# EAGLE design ProgrammateurFilPilote_1.1.1 (EAGLE 6.5.0)
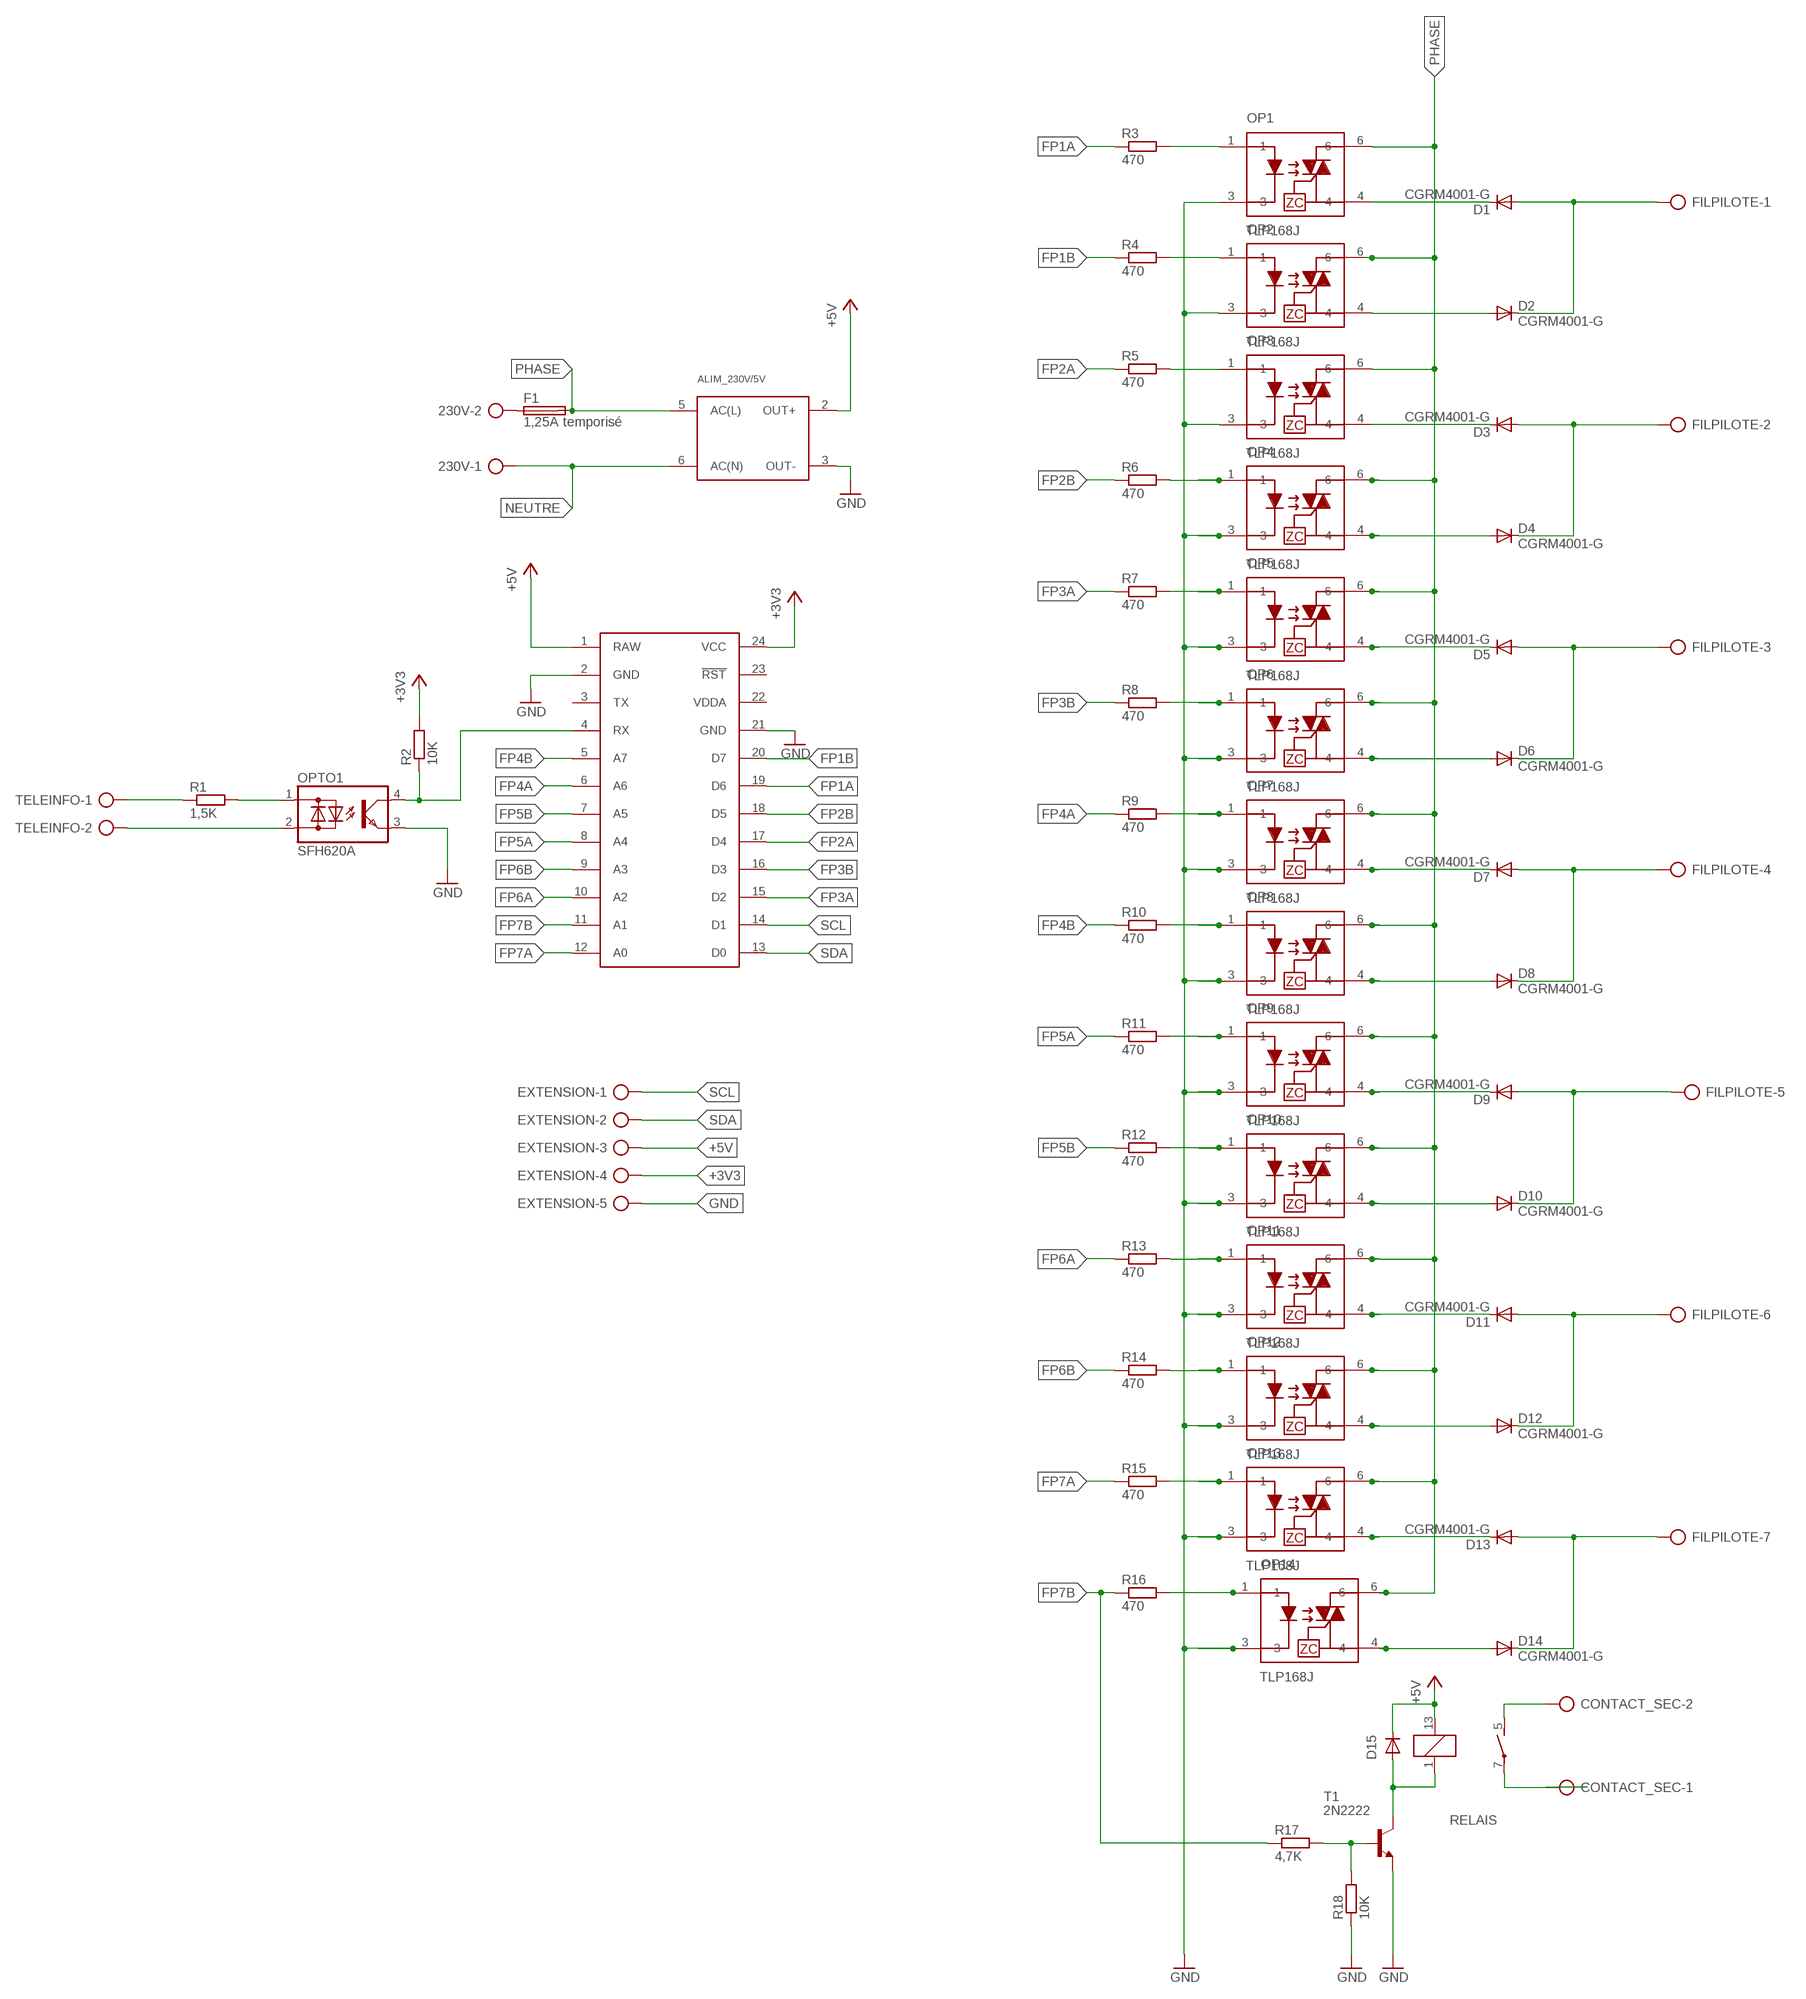
[diagram p0: schematic, sheet 1]

## Parts
230V  AK500/2  [AK500/2]
ALIM_230V/5V  TMLM04-SINGLE  [TMLM04]
CONTACT_SEC  AK500/2  [AK500/2]
D1  CGRM4001-G  [SOD-123_MINI-SMA]
D2  CGRM4001-G  [SOD-123_MINI-SMA]
D3  CGRM4001-G  [SOD-123_MINI-SMA]
D4  CGRM4001-G  [SOD-123_MINI-SMA]
D5  CGRM4001-G  [SOD-123_MINI-SMA]
D6  CGRM4001-G  [SOD-123_MINI-SMA]
D7  CGRM4001-G  [SOD-123_MINI-SMA]
D8  CGRM4001-G  [SOD-123_MINI-SMA]
D9  CGRM4001-G  [SOD-123_MINI-SMA]
D10  CGRM4001-G  [SOD-123_MINI-SMA]
D11  CGRM4001-G  [SOD-123_MINI-SMA]
D12  CGRM4001-G  [SOD-123_MINI-SMA]
D13  CGRM4001-G  [SOD-123_MINI-SMA]
D14  CGRM4001-G  [SOD-123_MINI-SMA]
D15  CGRM4001-G  [SOD-123_MINI-SMA]
EXTENSION  AK500/5  [AK500/5]
F1  1,25A temporisé  TE5  [TE5]
FILPILOTE  AK500/7  [AK500/7]
OP1  TLP168J  [MFSOP-4]
OP2  TLP168J  [MFSOP-4]
OP3  TLP168J  [MFSOP-4]
OP4  TLP168J  [MFSOP-4]
OP5  TLP168J  [MFSOP-4]
OP6  TLP168J  [MFSOP-4]
OP7  TLP168J  [MFSOP-4]
OP8  TLP168J  [MFSOP-4]
OP9  TLP168J  [MFSOP-4]
OP10  TLP168J  [MFSOP-4]
OP11  TLP168J  [MFSOP-4]
OP12  TLP168J  [MFSOP-4]
OP13  TLP168J  [MFSOP-4]
OP14  TLP168J  [MFSOP-4]
OPTO1  SFH620A  [DIL04]
R1  1,5K  R-EU_R1206  [R1206]
R2  10K  R-EU_R1206  [R1206]
R3  470  R-EU_R1206  [R1206]
R4  470  R-EU_R1206  [R1206]
R5  470  R-EU_R1206  [R1206]
R6  470  R-EU_R1206  [R1206]
R7  470  R-EU_R1206  [R1206]
R8  470  R-EU_R1206  [R1206]
R9  470  R-EU_R1206  [R1206]
R10  470  R-EU_R1206  [R1206]
R11  470  R-EU_R1206  [R1206]
R12  470  R-EU_R1206  [R1206]
R13  470  R-EU_R1206  [R1206]
R14  470  R-EU_R1206  [R1206]
R15  470  R-EU_R1206  [R1206]
R16  470  R-EU_R1206  [R1206]
R17  4,7K  R-EU_R1206  [R1206]
R18  10K  R-EU_R1206  [R1206]
RELAIS  Relais G6D  G6D-1A-ASI12VDC  [G6D]
SPARKCORE  SPARK_CORECORE  [SPARK_CORE]
T1  2N2222  2N2222-NPN-TO92-EBC  [TO92-EBC]
TELEINFO  AK500/2  [AK500/2]

## Nets
+3V3: EXTENSION.4 R2.2 SPARKCORE.24(VCC)
+5V: ALIM_230V/5V.2(OUT+) D15.C EXTENSION.3 RELAIS.13 SPARKCORE.1(RAW)
FP1A: R3.1 SPARKCORE.19(D6)
FP1B: R4.1 SPARKCORE.20(D7)
FP2A: R5.1 SPARKCORE.17(D4)
FP2B: R6.1 SPARKCORE.18(D5)
FP3A: R7.1 SPARKCORE.15(D2)
FP3B: R8.1 SPARKCORE.16(D3)
FP4A: R9.1 SPARKCORE.6(A6)
FP4B: R10.1 SPARKCORE.5(A7)
FP5A: R11.1 SPARKCORE.8(A4)
FP5B: R12.1 SPARKCORE.7(A5)
FP6A: R13.1 SPARKCORE.10(A2)
FP6B: R14.1 SPARKCORE.9(A3)
FP7A: R15.1 SPARKCORE.12(A0)
FP7B: R16.1 R17.1 SPARKCORE.11(A1)
GND: ALIM_230V/5V.3(OUT-) EXTENSION.5 OP1.3 OP2.3 OP3.3 OP4.3 OP5.3 OP6.3 OP7.3 OP8.3 OP9.3 OP10.3 OP11.3 OP12.3 OP13.3 OP14.3 OPTO1.3(E) R18.1 SPARKCORE.2(GND) SPARKCORE.21(GND) T1.E
N$1: D1.C OP1.4
N$2: D2.A OP2.4
N$3: OPTO1.2(AC2) TELEINFO.2
N$4: OPTO1.1(AC1) R1.2
N$5: R1.1 TELEINFO.1
N$6: OPTO1.4(C) R2.1 SPARKCORE.4(RX)
N$7: OP1.1 R3.2
N$8: OP2.1 R4.2
N$9: OP3.1 R5.2
N$10: OP4.1 R6.2
N$11: OP5.1 R7.2
N$12: OP6.1 R8.2
N$13: OP7.1 R9.2
N$14: OP8.1 R10.2
N$15: D15.A RELAIS.1 T1.C
N$17: 230V.2 F1.1
N$18: CONTACT_SEC.2 RELAIS.5(2:S)
N$19: OP9.1 R11.2
N$20: CONTACT_SEC.1 RELAIS.7(2:P)
N$21: R17.2 R18.2 T1.B
N$22: D3.C OP3.4
N$23: D3.A D4.C FILPILOTE.2
N$24: D5.C OP5.4
N$25: D4.A OP4.4
N$26: D7.C OP7.4
N$27: D5.A D6.C FILPILOTE.3
N$28: D1.A D2.C FILPILOTE.1
N$29: D6.A OP6.4
N$30: D7.A D8.C FILPILOTE.4
N$31: D8.A OP8.4
N$32: OP10.1 R12.2
N$34: OP14.1 R16.2
N$42: D9.C OP9.4
N$46: D9.A D10.C FILPILOTE.5
N$47: OP11.1 R13.2
N$48: OP12.1 R14.2
N$49: D10.A OP10.4
N$50: D11.A D12.C FILPILOTE.6
N$51: D12.A OP12.4
NEUTRE: 230V.1 ALIM_230V/5V.6(AC(N))
PHASE: ALIM_230V/5V.5(AC(L)) F1.2 OP1.6 OP2.6 OP3.6 OP4.6 OP5.6 OP6.6 OP7.6 OP8.6 OP9.6 OP10.6 OP11.6 OP12.6 OP13.6 OP14.6
S$1: D11.C OP11.4
S$3: D13.C OP13.4
S$5: OP13.1 R15.2
S$6: D13.A D14.C FILPILOTE.7
S$11: D14.A OP14.4
SCL: EXTENSION.1 SPARKCORE.14(D1)
SDA: EXTENSION.2 SPARKCORE.13(D0)
Unconnected: SPARKCORE.3(TX) SPARKCORE.23(!RST)

## Power pins joined to a net without a drawn wire
VDDA: SPARKCORE.22(VDDA)

## Library data of the parts
230V TELEINFO = con-ptr500:AK500/2: CONNECTOR; OC_FARNELL: unknown; OC_NEWARK: unknown
ALIM_230V/5V = Traco-TMLM04:TMLM04-SINGLE
CONTACT_SEC = con-ptr500:AK500/2: CONNECTOR
D1-D15 = diode:CGRM400*-G: Molded plasitc,JEDEC SOD-123/Mini SMA Source: Comchip CGRM4001-G.pdf
EXTENSION = con-ptr500:AK500/5: CONNECTOR; OC_FARNELL: unknown; OC_NEWARK: unknown
F1 = fuse:TE5: FUSE Wickmann; OC_FARNELL: unknown; OC_NEWARK: unknown
FILPILOTE = con-ptr500:AK500/7: CONNECTOR; OC_FARNELL: unknown; OC_NEWARK: unknown
OP1-OP14 = TLP168J:TLP168J
OPTO1 = optocoupler:SFH620: Optocoupler, Phototransistor Output, AC Input Source: http://www.vishay.com/docs/83675/sfh620.pdf; MPN: SFH620A-2; OC_FARNELL: 1469594; OC_NEWARK: 97K9546
R1-R18 = resistor:R-EU_: RESISTOR, European symbol
RELAIS = relay:G6D?*: OMRON Slim, Miniature PCB Relay 17.5 × 6.5 × 12.5 mm with Socked Source: http://ecb.omron.com.sg/pdf/relay/power/G6D.pdf
SPARKCORE = Spark:SPARK_CORE
T1 = transistor-neu-to92:*-NPN-: NPN Transistror

## Net classes
0 default: width 0.305 mm, drill 0.508 mm, clearance 0.254 mm

## Board
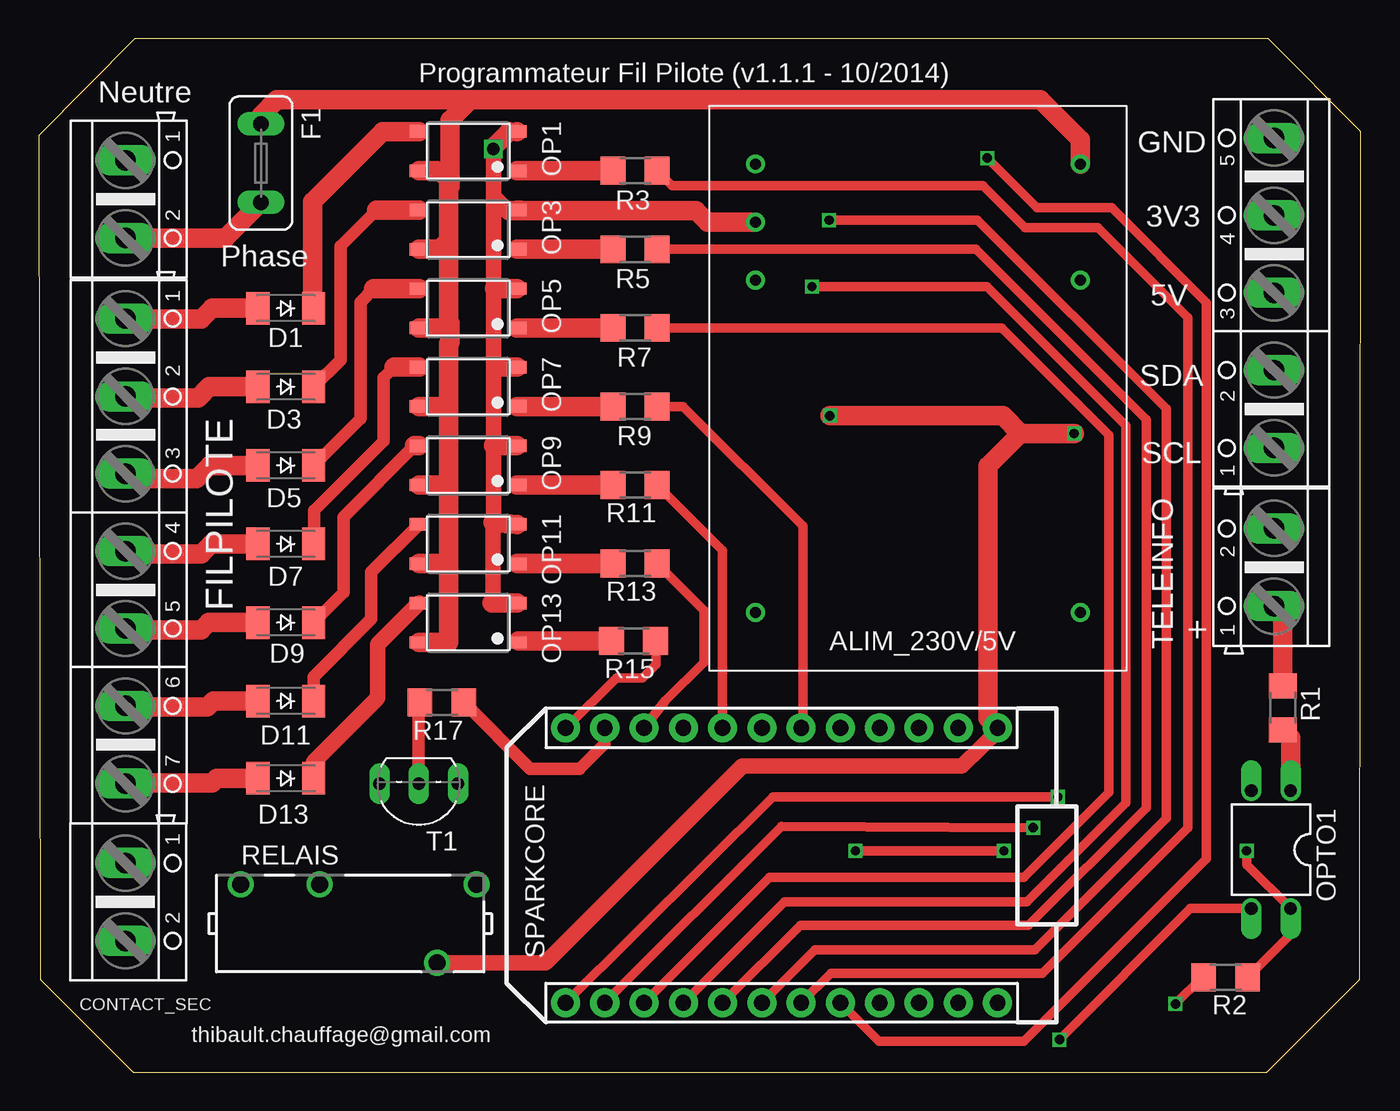
[diagram p1: board, top side]
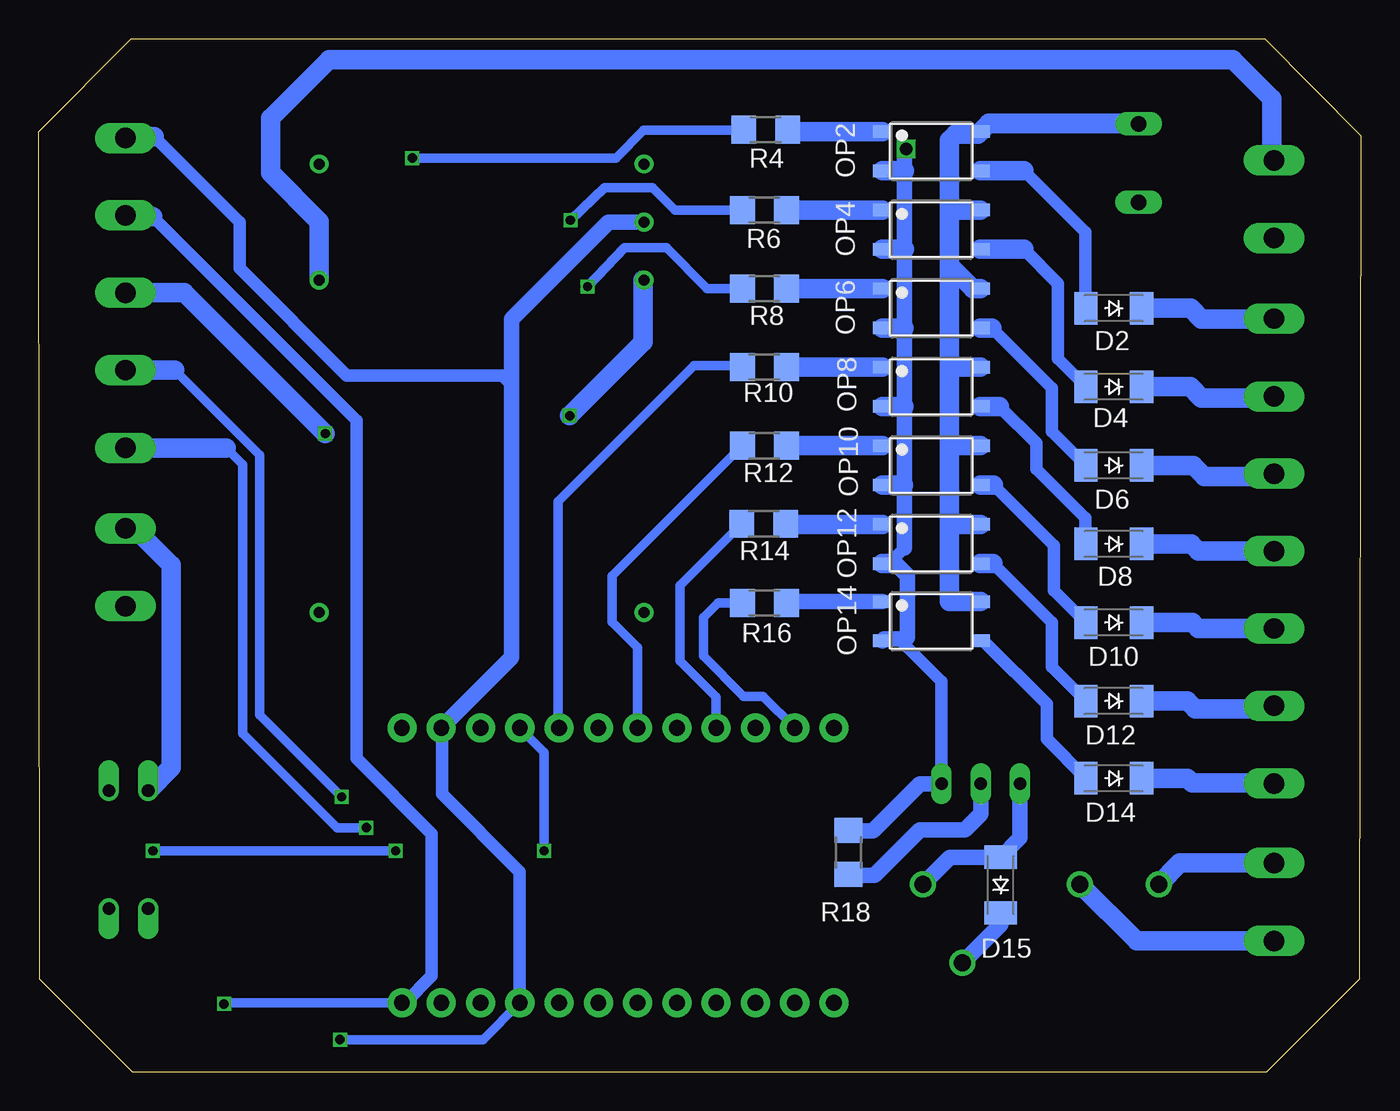
[diagram p2: board, bottom side, seen from below]

Size 85.49 x 66.83 mm. Coordinates in mm from the lower left corner, seen from the top.
Outline: 0,60.54 0.12,6.01 6.12,0 79.41,0 85.41,5.99 85.49,60.82 79.49,66.83 6.2,66.83 0,60.54
Copper layers (1*16): Top 0.035mm / dielectric 1.5mm / Bottom 0.035mm
Design rules "Elecrow_2-layer_eagle_rule": minimum track width 6mil, minimum drill 12mil, track to track 6mil, track to pad 6mil, pad to pad 6mil, via to via 6mil, smd to smd 0mil, copper to edge 10mil, drill to drill 10mil, minimum pad ring 10mil, minimum via ring 6mil, stop-mask expansion 2mil, vias tented up to drill 100mil, thermal gap 10mil

### Footprints (pad centres in the part's own frame; a part is rotated, then mirrored left to right if it is on the bottom)
AK500/2 = drill 1.321 long: 1 -2.515,0; 2 2.515,0
TMLM04 = drill 0.7: 1 3,3.75; 2 3,25.25; 3 3,29; 4 3,32.75; 5 24,32.75; 6 24,25.25; 7 24,3.75
SOD-123_MINI-SMA = smd 1.5 x 2.1: A 1.8,0; C -1.8,0
AK500/5 = drill 1.321 long: 1 -10.033,0; 2 -5.004,0; 3 0,0; 4 5.004,0; 5 10.008,0
TE5 = drill 1.016 long: 1 -2.54,0; 2 2.54,0
AK500/7 = drill 1.321 long: 1 -15.037,0; 2 -10.008,0; 3 -5.004,0; 4 0,0; 5 5.004,0; 6 10.008,0; 7 15.037,0
MFSOP-4 = smd 0.8 x 1.2: 1 2.54,0; 3 0,0; 4 0,-6.35; 6 2.54,-6.35
DIL04 = drill 0.813 offset: 1 -1.27,-3.81; 2 1.27,-3.81; 3 1.27,3.81; 4 -1.27,3.81
R1206 = smd 1.6 x 1.803: 1 -1.422,0; 2 1.422,0
G6D = drill 1.1 pad 1.676: 1 8.08,2.5; 5 -2.08,2.5; 7 -7.16,2.5; 13 5.54,-2.58
SPARK_CORE = drill 1.016 pad 1.88: 1 -8.89,13.97; 2 -8.89,11.43; 3 -8.89,8.89; 4 -8.89,6.35; 5 -8.89,3.81; 6 -8.89,1.27; 7 -8.89,-1.27; 8 -8.89,-3.81; 9 -8.89,-6.35; 10 -8.89,-8.89; 11 -8.89,-11.43; 12 -8.89,-13.97; 13 8.89,-13.97; 14 8.89,-11.43; 15 8.89,-8.89; 16 8.89,-6.35; 17 8.89,-3.81; 18 8.89,-1.27; 19 8.89,1.27; 20 8.89,3.81; 21 8.89,6.35; 22 8.89,8.89; 23 8.89,11.43; 24 8.89,13.97
TO92-EBC = drill 0.813 long: B 0,-1.27; C 2.54,-1.27; E -2.54,-1.27

### Placement (x,y rotation side)
230V  5.62,56.45 270 top
ALIM_230V/5V  43.35,25.97 0 top
CONTACT_SEC  5.61,11 270 top
D1  15.97,49.39 180 top
D2  15.97,49.39 180 bottom
D3  15.97,44.31 180 top
D4  15.97,44.31 180 bottom
D5  15.97,39.23 180 top
D6  15.97,39.23 180 bottom
D7  15.97,34.16 180 top
D8  15.97,34.16 180 bottom
D9  15.97,29.07 180 top
D10  15.97,29.07 180 bottom
D11  15.97,23.99 180 top
D12  15.97,23.99 180 bottom
D13  15.97,18.99 180 top
D14  15.97,18.99 180 bottom
D15  23.29,12.1 90 bottom
EXTENSION  79.89,50.4 90 top
F1  14.37,58.78 90 top
FILPILOTE  5.62,33.69 270 top
OP1  30.94,60.82 270 top
OP2  30.94,58.28 90 bottom
OP3  30.94,55.74 270 top
OP4  30.94,53.2 90 bottom
OP5  30.94,50.66 270 top
OP6  30.94,48.12 90 bottom
OP7  30.94,45.59 270 top
OP8  30.94,43.05 90 bottom
OP9  30.94,40.5 270 top
OP10  30.94,37.96 90 bottom
OP11  30.94,35.42 270 top
OP12  30.94,32.88 90 bottom
OP13  30.94,30.32 270 top
OP14  30.94,27.88 90 bottom
OPTO1  79.68,14.38 180 top
R1  80.44,23.55 270 top
R2  76.75,6.14 180 top
R3  38.56,58.28 180 top
R4  38.48,60.93 0 bottom
R5  38.56,53.2 180 top
R6  38.56,55.74 0 bottom
R7  38.56,48.12 180 top
R8  38.56,50.66 0 bottom
R9  38.56,43.05 180 top
R10  38.56,45.59 0 bottom
R11  38.56,37.96 180 top
R12  38.56,40.5 0 bottom
R13  38.56,32.88 180 top
R14  38.61,35.46 0 bottom
R15  38.46,27.88 180 top
R16  38.56,30.34 0 bottom
R17  26.08,23.89 180 top
R18  33.13,14.2 270 bottom
RELAIS  20.24,9.64 0 top
SPARKCORE  48.03,13.37 270 top
T1  24.57,17.37 180 top
TELEINFO  79.89,32.65 90 top

### Tracks (layer width: path | path; a pad name or v marks a point on that pad's centre or on a via)
+3V3  (via drill 0.6)
  Top 0.61: R2.2 75.25,6.14 v73.51,4.4
  Bottom 0.61: SPARKCORE.24 73.43,4.47 v73.51,4.4
  Bottom 0.813: SPARKCORE.24 61.81,4.47 60.07,6.22 60.07,15.42 64.95,20.3 64.95,42.14 78.14,55.33
  Bottom 1.27: 78.14,55.33 79.81,55.33 EXTENSION.4
+5V  (via drill 0.6)
  Top 0.813: 62.11,22.15 SPARKCORE.1
  Top 1.016: 62.11,22.15 59.71,19.8 45.51,19.8 32.77,7.06 RELAIS.13
  Top 1.27: 63.49,41.31 61.37,39.2 61.37,22.89 SPARKCORE.1 | v66.96,41.29 63.51,41.29 63.49,41.31 | v51.15,42.45 62.35,42.45 63.49,41.31
  Bottom 1.016: D15.C 23.29,9.55 RELAIS.13 | ALIM_230V/5V.2 46.41,51.22
  Bottom 1.27: EXTENSION.3 76.07,50.4 v66.96,41.29 | 46.41,51.22 46.41,47.19 v51.15,42.45
FP1A
  Top 0.61: SPARKCORE.19 51.23,6.4 64.91,6.4 74.31,15.8 74.31,48.79 68.48,54.62 63.77,54.62 61.07,57.32 40.95,57.32 R3.1
FP1B  (via drill 0.6)
  Top 0.61: SPARKCORE.20 54.32,2 63.71,2 75.51,13.8 75.51,49.77 69.38,55.9 64.54,55.9 v61.33,59.11
  Bottom 0.61: v61.33,59.11 48.16,59.11 46.38,60.9 39.94,60.9 R4.1
  Bottom 0.813: R4.1 39.9,61 39.81,61.1
FP2A
  Top 0.61: R5.1 60.6,53.2 71.61,42.2 71.61,17.1 64.01,9.5 49.25,9.5 SPARKCORE.17
FP2B  (via drill 0.6)
  Top 0.61: v51.11,55.1 60.71,55.1 72.91,42.9 72.91,16.4 64.41,7.9 50.19,7.9 SPARKCORE.18
  Bottom 0.61: R6.1 44.35,55.74 45.81,57.2 48.91,57.2 v51.11,55.1
FP3A
  Top 0.61: R7.1 62.28,48.12 69.21,41.2 69.21,18.1 63.71,12.6 47.27,12.6 SPARKCORE.15
FP3B  (via drill 0.6)
  Top 0.61: v50.01,50.8 61.31,50.8 70.31,41.8 70.31,17.4 63.91,11 48.21,11 SPARKCORE.16
  Bottom 0.61: R8.1 42.27,50.66 44.91,53.3 47.61,53.3 v50.01,50.8
FP4A
  Top 0.61: R9.1 41.66,43.05 49.41,35.3 49.41,22.36 SPARKCORE.6
FP4B
  Bottom 0.61: R10.1 40.09,45.59 40.21,45.7 43.11,45.7 51.91,36.9 51.91,22.32 SPARKCORE.5
FP5A
  Top 0.61: SPARKCORE.8 44.22,33.73 R11.1
FP5B
  Bottom 0.61: SPARKCORE.7 46.76,27.45 48.41,29.1 48.41,32.08 R12.1
FP6A
  Top 0.61: SPARKCORE.10 40.54,24.04 43.01,26.5 43.01,29.86 R13.1
FP6B
  Bottom 0.61: SPARKCORE.9 41.68,24.27 44.01,26.6 44.01,31.48 R14.1
FP7A
  Top 0.61: SPARKCORE.12 34.11,22.25 37.35,25.5 39.04,25.5 39.91,26.37 39.91,27.86 R15.1
FP7B
  Top 0.813: SPARKCORE.11 36.6,21.23 34.98,19.61 31.79,19.61 R17.1
  Bottom 0.61: R16.1 41.56,30.34 42.51,29.4 42.51,26.9 39.91,24.3 38.65,24.3 SPARKCORE.11
GND  (via drill 0.6, 0.8)
  Top 0.61: OPTO1.3 74.48,10.58 v66.01,2.1 | 30.41,55.7 29.41,56.7
  Top 0.813: OP3.3 30.97,55.74 31.19,55.97 | 30.99,55.7 30.51,55.7 29.41,56.8 | 30.92,60.8 30.41,60.8 30.21,60.8 29.41,60 v29.41,59.7 29.41,59.8 | 29.38,35.52 29.41,35.6 | 29.41,40.5 | 29.69,45.59 29.41,45.3 | 29.47,50.66 29.41,50.6
  Top 1.016: 29.41,56.8 v29.41,59.7 | 29.41,56.7 29.41,50.6 29.41,45.3 29.41,40.5 29.41,35.6 | 29.31,30.32 29.31,30.3 29.38,30.4 29.38,35.52
  Top 1.27: ALIM_230V/5V.3 43.24,54.97 42.51,55.7 30.99,55.7 | 30.99,55.7 OP3.3 | 30.92,60.8 OP1.3 | 30.99,55.7 30.41,55.7 | OP11.3 29.38,35.52 | OP9.3 29.41,40.5 | OP7.3 29.69,45.59 | OP5.3 29.47,50.66 | 29.41,59.8 30.41,60.8 | OP13.3 29.31,30.32
  Bottom 0.61: 59.41,22.2 SPARKCORE.2 | v66.01,2.1 56.76,2.1 SPARKCORE.21
  Bottom 0.813: 29.51,59.6 v29.41,59.7 | 30.52,32.88 29.51,33.9 | 29.57,37.96 29.51,37.9 | 29.55,43.05 29.51,43 | 29.53,48.12 29.51,48.1 | 29.51,53.2 | 29.52,58.28 29.51,58.3 | T1.E 27.11,25.26 29.86,28 | SPARKCORE.21 54.38,12.94 59.42,17.98 59.42,22.21 SPARKCORE.2 | 54.91,44.42 55.54,45.05 65.58,45.05 72.51,51.98 72.51,54.96 78.04,60.49 | R18.1
  Bottom 1.016: ALIM_230V/5V.3 48.64,54.97 54.91,48.7 54.91,44.42 54.91,26.81 SPARKCORE.2 | 29.51,33.9 29.51,37.9 29.51,43 29.51,48.1 29.51,53.2 29.51,58.3 29.51,59.6 | OP12.3 30.09,32.88 29.31,32.1 29.31,28.1 29.41,28 29.86,28 30.83,28 OP14.3 | T1.E 28.53,18.64 31.56,15.6 33.11,15.6 R18.1
  Bottom 1.27: OP12.3 30.52,32.88 | OP10.3 29.57,37.96 | OP8.3 29.55,43.05 | OP6.3 29.53,48.12 | OP4.3 29.51,53.2 | OP2.3 29.52,58.28 | 78.04,60.49 79.81,60.49 EXTENSION.5
N$1
  Top 0.813: 17.71,49.46 D1.C
  Top 1.27: OP1.4 22.23,60.82 17.71,56.3 17.71,49.46
N$2
  Bottom 0.813: 21.78,58.28 17.8,54.31 17.8,49.42 D2.A
  Bottom 1.27: OP2.4 21.78,58.28
N$3
  Bottom 1.27: TELEINFO.2 79.27,35.16 76.91,32.8 76.91,19.7 OPTO1.2
N$4
  Top 0.813: 80.95,21.62 R1.2
  Top 1.27: OPTO1.1 80.95,21.62
N$5
  Top 1.27: R1.1 80.44,29.48 TELEINFO.1
N$6  (via drill 0.6)
  Top 0.61: v62.41,14.3 v52.81,14.3 | R2.1 80.95,8.91 OPTO1.4 78.11,13.42 v78.11,14.3
  Bottom 0.61: v78.11,14.3 v62.41,14.3 | v52.81,14.3 52.81,20.68 SPARKCORE.4
N$7
  Top 1.27: OP1.1 R3.2
N$8
  Bottom 0.813: 36.95,60.82 R4.2
  Bottom 1.27: OP2.1 36.95,60.82
N$9
  Top 1.27: OP3.1 R5.2
N$10
  Bottom 1.27: OP4.1 R6.2
N$11
  Top 1.27: OP5.1 R7.2
N$12
  Bottom 1.27: OP6.1 R8.2
N$13
  Top 1.27: OP7.1 R9.2
N$14
  Bottom 1.27: R10.2 OP8.1
N$15
  Bottom 1.016: T1.C 22.03,15.16 D15.A 26.56,13.9 RELAIS.1
N$17
  Top 1.27: 230V.2 12.06,53.93 F1.1
N$18
  Bottom 1.27: CONTACT_SEC.2 14.5,8.48 RELAIS.5
N$19
  Top 1.27: OP9.1 R11.2
N$20
  Bottom 1.27: CONTACT_SEC.1 11.7,13.52 RELAIS.7
N$21
  Top 0.813: T1.B 24.57,23.81 R17.2
  Bottom 1.016: T1.B 24.57,16.7 25.61,15.67 28.52,15.67 31.46,12.72 33.07,12.72 R18.2
N$22
  Top 0.813: 21.85,55.74 19.51,53.4 19.51,46.05 D3.C
  Top 1.27: OP3.4 21.85,55.74
N$23
  Top 0.813: 5.62,43.6 FILPILOTE.2
  Top 1.27: D4.C 11.02,44.31 10.31,43.6 5.62,43.6
  Bottom 0.813: 5.62,43.6 FILPILOTE.2
  Bottom 1.27: D4.C 11.02,44.31 10.31,43.6 5.62,43.6
N$24
  Top 0.813: 21.67,50.66 20.81,49.8 20.81,42.27 D5.C
  Top 1.27: OP5.4 21.67,50.66
N$25
  Bottom 0.813: 21.8,53.2 19.59,51 19.59,46.13 D4.A
  Bottom 1.27: OP4.4 21.8,53.2
N$26
  Top 0.813: 22.99,45.59 22.31,44.9 22.31,40.8 17.81,36.3 17.81,34.19 D7.C
  Top 1.27: OP7.4 22.99,45.59
N$27
  Top 0.813: 5.81,38.4 FILPILOTE.3
  Top 1.27: D6.C 11.04,39.23 10.21,38.4 5.81,38.4
  Bottom 0.813: 5.71,38.5 FILPILOTE.3
  Bottom 1.27: D6.C 10.84,39.23 10.11,38.5 5.71,38.5
N$28
  Top 0.813: 5.69,48.7 FILPILOTE.1
  Top 1.27: D2.C 11.2,49.39 10.51,48.7 5.69,48.7
  Bottom 0.813: 5.69,48.7 FILPILOTE.1
  Bottom 1.27: D2.C 11,49.39 10.31,48.7 5.69,48.7
N$29
  Bottom 0.813: 23.86,48.12 19.97,44.24 19.97,41.43 D6.A
  Bottom 1.27: OP6.4 23.86,48.12
N$30
  Top 0.813: 5.71,33.5 FILPILOTE.4
  Top 1.27: D8.C 11.16,34.16 10.51,33.5 5.71,33.5
  Bottom 0.813: 5.73,33.7 FILPILOTE.4
  Bottom 1.27: D8.C 10.96,34.16 10.51,33.7 5.73,33.7
N$31
  Bottom 0.813: 23.37,43.05 20.99,40.67 20.99,39.01 17.8,35.82 17.8,34.18 D8.A
  Bottom 1.27: OP8.4 23.37,43.05
N$32
  Bottom 1.27: R12.2 OP10.1
N$34
  Bottom 1.016: OP14.1 37.06,30.42 R16.2
N$42
  Top 0.813: 24.31,40.5 19.71,35.9 19.71,31.01 D9.C
  Top 1.27: OP9.4 24.31,40.5
N$46
  Top 0.813: 5.63,28.6 FILPILOTE.5
  Top 1.27: D10.C 10.98,29.07 10.51,28.6 5.63,28.6
  Bottom 0.813: 5.73,28.7 FILPILOTE.5
  Bottom 1.27: D10.C 10.88,29.07 10.51,28.7 5.73,28.7
N$47
  Top 1.27: OP11.1 R13.2
N$48
  Bottom 0.813: 37.15,35.42 R14.2
  Bottom 1.27: OP12.1 37.15,35.42
N$49
  Bottom 0.813: 23.77,37.96 19.84,34.04 19.84,31.14 D10.A
  Bottom 1.27: OP10.4 23.77,37.96
N$50
  Top 0.813: 5.64,23.6 FILPILOTE.6
  Top 1.27: D12.C 11.3,23.99 10.91,23.6 5.64,23.6
  Bottom 0.813: 5.7,23.5 FILPILOTE.6
  Bottom 1.27: D12.C 11.2,23.99 10.71,23.5 5.7,23.5
N$51
  Bottom 0.813: 23.79,32.88 19.97,29.07 19.97,26.19 D12.A
  Bottom 1.27: OP12.4 23.79,32.88
NEUTRE
  Bottom 1.27: ALIM_230V/5V.6 67.35,55.01 70.5,58.15 70.5,61.69 66.72,65.47 8.28,65.47 5.76,62.95 5.76,59.1 230V.1
PHASE  (via drill 0.6)
  Top 0.813: 26.51,57.5 25.72,58.28 25.72,58.18 26.61,57.3 | 25.97,37.96 26.51,38.5 | 26.51,43.5 26.05,43.05 26.55,43.05 26.61,43.1 | 25.83,48.12 26.51,48.8 26.51,47.1 26.61,47.2 | 26.61,60 26.41,60 | 26.33,48.12 26.61,48.4
  Top 1.27: OP1.6 25.72,58.28 | 26.51,57.5 26.51,53.8 | 26.51,53.8 26.51,48.8 | 26.51,47.1 26.51,43.5 26.51,38.5 26.51,32.88 | OP7.6 26.05,43.05 | OP5.6 25.83,48.12 26.33,48.12 | OP3.6 25.91,53.2 26.51,53.8 | 26.61,57.3 26.61,60 26.61,61.55 27.93,62.87 | 26.61,48.4 26.61,47.2 | OP9.6 25.97,37.96 | OP11.6 26.51,32.88 | OP13.6 26.51,27.79 26.51,32.88 | v14.37,61.36 14.37,61.85 15.39,62.87 27.93,62.87 | 27.93,62.87 64.79,62.87 67.35,60.3 ALIM_230V/5V.5
  Bottom 0.813: 25.95,55.74 26.61,56.4 | 26.6,40.5 26.61,40.5 | 26.49,45.59 26.61,45.7 | 26.58,35.42 26.61,35.4 | OP14.6 24.53,30.42
  Bottom 1.27: 26.61,52.2 26.61,56.4 26.61,60.26 26.22,60.65 24.77,60.65 OP2.6 | 26.61,52.2 26.61,45.7 26.61,40.5 26.61,35.9 | 26.61,35.9 26.61,35.4 26.61,30.42 OP14.6 | OP6.6 25.07,50.66 26.61,52.2 | OP4.6 25.95,55.74 | OP10.6 26.6,40.5 | OP8.6 26.49,45.59 | OP12.6 26.58,35.42 | 26.51,35.8 26.61,35.9 | v14.37,61.36 24.06,61.36 OP2.6 | F1.2 24.1,61.32 OP2.6
S$1
  Top 0.813: D11.C 17.77,25.56 21.51,29.3 21.51,32.34 OP11.4
S$3
  Top 1.016: D13.C 17.77,20.06 21.91,24.2 21.91,27.64 OP13.4
S$5
  Top 0.61: 31.04,27.88 OP13.1
  Top 1.27: R15.2 31.04,27.88
S$6
  Top 1.27: D14.C 11.5,18.99 11.21,18.7 5.67,18.7 FILPILOTE.7
  Bottom 1.27: D14.C 11.2,18.99 10.91,18.7 5.67,18.7 FILPILOTE.7
S$11
  Bottom 0.813: OP14.4 24.39,27.88 20.31,23.8 20.31,21.53 D14.A
SCL  (via drill 0.6)
  Top 0.61: SPARKCORE.14 48.03,15.9 v64.31,15.8
  Bottom 0.61: 73.38,40.37 72.31,39.3 72.31,21.9 66.21,15.8 v64.31,15.8
  Bottom 1.27: EXTENSION.1 73.38,40.37
SDA  (via drill 0.6)
  Top 0.61: v65.91,17.8 47.49,17.8 SPARKCORE.13
  Bottom 0.61: 76.71,45.4 71.21,39.9 71.21,23.1 v65.91,17.8
  Bottom 1.27: EXTENSION.2 76.71,45.4

### Text on the board
tPlace: Programmateur Fil Pilote (v1.1.1 - 10/2014) | thibault.chauffage@gmail.com
tNames: Neutre | GND | 3V3 | Phase | 5V | SDA | SCL | +